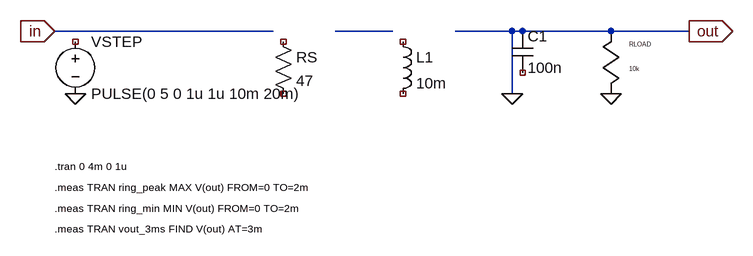
[diagram p0: schematic rlc_step_ringing.asc]
rlc_step_ringing.asc, the LTspice schematic file:
Version 4
SHEET 1 1261 807
WIRE 64 288 400 288
WIRE 496 288 584 288
WIRE 680 288 1040 288
WIRE 768 288 768 384
SYMBOL voltage 96 288 R0
SYMATTR InstName VSTEP
SYMATTR Value PULSE(0 5 0 1u 1u 10m 20m)
SYMBOL res 400 288 R0
SYMATTR InstName RS
SYMATTR Value 47
SYMBOL ind 584 288 R0
SYMATTR InstName L1
SYMATTR Value 10m
SYMBOL cap 768 288 R0
SYMATTR InstName C1
SYMATTR Value 100n
SYMBOL res_v 920 288 R0
SYMATTR InstName RLOAD
SYMATTR Value 10k
FLAG 64 288 in
IOPIN 64 288 In
FLAG 1040 288 out
IOPIN 1040 288 Out
FLAG 96 384 0
FLAG 768 384 0
FLAG 920 384 0
TEXT 64 496 Left 1 !.tran 0 4m 0 1u
TEXT 64 528 Left 1 !.meas TRAN ring_peak MAX V(out) FROM=0 TO=2m
TEXT 64 560 Left 1 !.meas TRAN ring_min MIN V(out) FROM=0 TO=2m
TEXT 64 592 Left 1 !.meas TRAN vout_3ms FIND V(out) AT=3m

The netlist it stands for:
* rlc_step_ringing.asc
VSTEP NC_01 0 PULSE(0 5 0 1u 1u 10m 20m)
RS NC_02 NC_03 47
L1 NC_04 NC_05 10m
C1 0 NC_06 100n
RLOAD 0 0 10k
.tran 0 4m 0 1u
.meas TRAN ring_peak MAX V(out) FROM=0 TO=2m
.meas TRAN ring_min MIN V(out) FROM=0 TO=2m
.meas TRAN vout_3ms FIND V(out) AT=3m
.backanno
.end